# Altium project Receiver - Student Version.PrjPcb
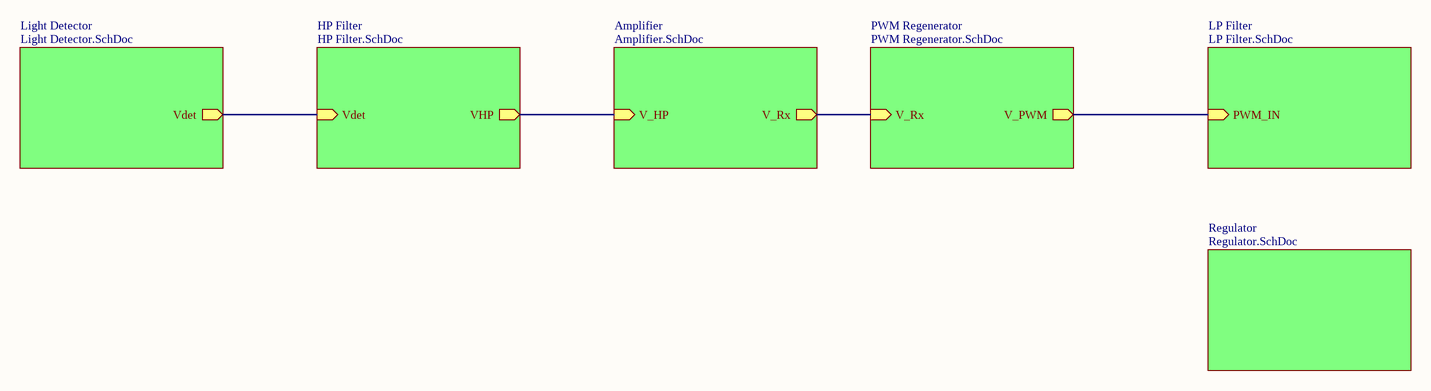
[diagram p0: Receiver.SchDoc]
7 sheets, 36 parts. Net scope: hierarchical (ports join the sheet entries above them; power ports are global).
Board file: Receiver.PcbDoc
Sheets:
  Receiver.SchDoc
    Light Detector = Light Detector.SchDoc
    HP Filter = HP Filter.SchDoc
    Amplifier = Amplifier.SchDoc
    PWM Regenerator = PWM Regenerator.SchDoc
    LP Filter = LP Filter.SchDoc
    Regulator = Regulator.SchDoc

## Sheet Receiver.SchDoc
size A4; SheetNumber: 1; SheetTotal: 6

### Sub-sheets
Amplifier = Amplifier.SchDoc: V_HP (in), V_Rx (out)
HP Filter = HP Filter.SchDoc: VHP (out), Vdet (in)
Light Detector = Light Detector.SchDoc: Vdet (out)
LP Filter = LP Filter.SchDoc: PWM_IN (in)
PWM Regenerator = PWM Regenerator.SchDoc: V_Rx (in), V_PWM (out)
Regulator = Regulator.SchDoc: no entries

### Nets
NetC2_2: sheet Light Detector/Vdet, sheet HP Filter/Vdet
NetC3_2: sheet HP Filter/VHP, sheet Amplifier/V_HP, sheet Amplifier/V_Rx, sheet PWM Regenerator/V_Rx
NetR8_1: sheet PWM Regenerator/V_PWM, sheet LP Filter/PWM_IN

## Sheet Light Detector.SchDoc
size A4; SheetNumber: 2; SheetTotal: 7
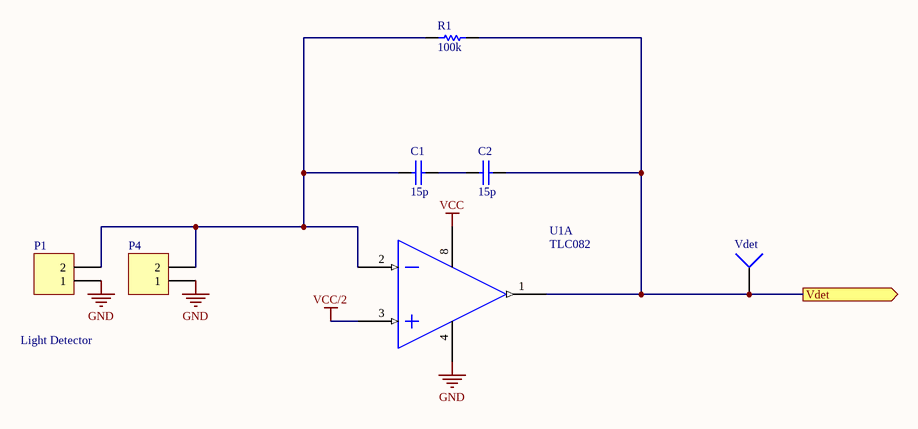
[diagram p1: Light Detector.SchDoc]

### Parts
C1  15p  [ece-RAD0.2]
C2  15p  [ece-RAD0.2]
P1  Header 2  [ece-HDR1X2]  (value not drawn)
P4  Header 2  [ece-HDR1X2]  (value not drawn)
R1  100k  [ece-AXIAL0.4]
U1  TLC082  [ECE-DIP8]  (part A of 2)
VOFF  Vdet  [ece-HDR1]

### Ports
Vdet (out)

### Nets
GND: P1.1 P4.1 U1.4(GND)
VCC: U1.8(V(+))
VCC/2: U1.3(IN1(+))
NetC1_1: C1.1 P1.2 P4.2 R1.1 U1.2(IN1(-))
NetC1_2: C1.2 C2.1
NetC2_2: C2.2 R1.2 U1.1(OUT1) VOFF.1 ; port Vdet

### Notes on the sheet
- Light Detector

### Library data of the parts
C1 C2 = CAP: Capacitor Non Polarised Through Hole; Value: 15p
P1 P4 = Header 2: Header, 2-Pin; LatestRevisionDate: 17-Jul-2002; LatestRevisionNote: Re-released for DXP Platform.; Publisher: Altium Limited
R1 = Res1: Resistor; Published: 8-Jun-2000; LatestRevisionDate: 17-Jul-2002; LatestRevisionNote: Re-released for DXP Platform.; PackageReference: AXIAL-0.3; Publisher: Altium Limited; Value: 100k
VOFF = Test pin: Socket; LatestRevisionDate: 17-Jul-2002; LatestRevisionNote: Re-released for DXP Platform.; Publisher: Altium Limited
U1 = TLC082: Value: TLC082

## Sheet HP Filter.SchDoc
size A4; SheetNumber: 3; SheetTotal: 7
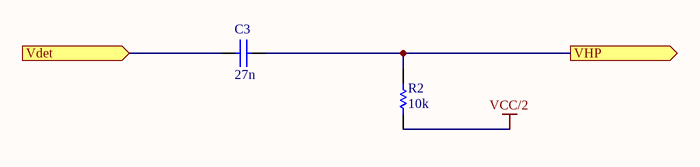
[diagram p2: HP Filter.SchDoc]

### Parts
C3  27n  [ece-RAD0.2]
R2  10k  [ece-AXIAL0.4]

### Ports
Vdet (in), VHP (out)

### Nets
VCC/2: R2.1
NetC2_2: C3.1 ; port Vdet
NetC3_2: C3.2 R2.2 ; port VHP

### Library data of the parts
C3 = CAP: Capacitor Non Polarised Through Hole; Value: 27n
R2 = Res1: Resistor; Published: 8-Jun-2000; LatestRevisionDate: 17-Jul-2002; LatestRevisionNote: Re-released for DXP Platform.; PackageReference: AXIAL-0.3; Publisher: Altium Limited; Value: 10k

## Sheet Amplifier.SchDoc
size A4; SheetNumber: 4; SheetTotal: 7
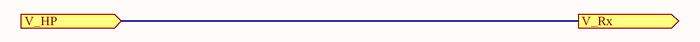
[diagram p3: Amplifier.SchDoc]

### Ports
V_HP (in), V_Rx (out)

### Nets
NetC3_2: port V_HP, port V_Rx

## Sheet PWM Regenerator.SchDoc
size A4; SheetNumber: 5; SheetTotal: 7
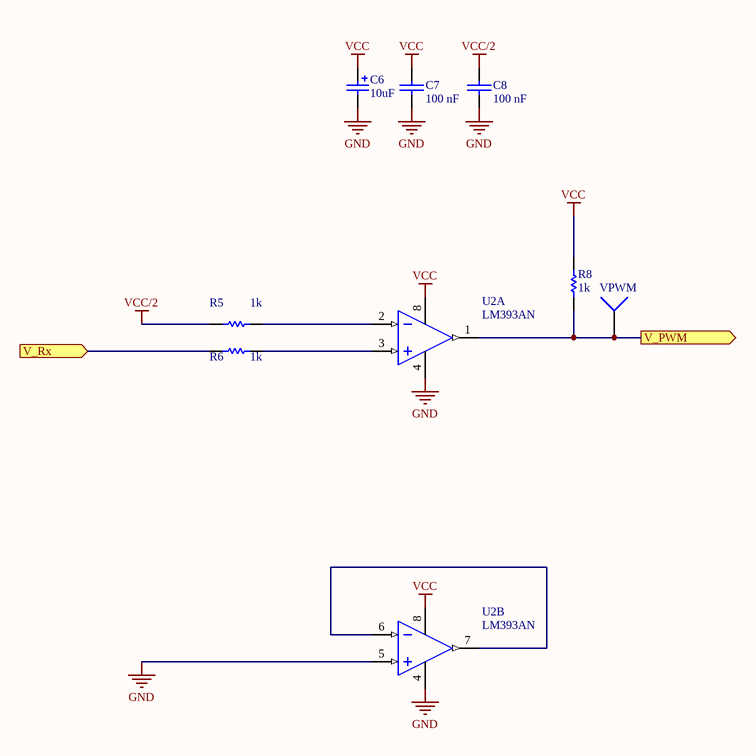
[diagram p4: PWM Regenerator.SchDoc]

### Parts
C6  10uF  [ece-CAPAD2TH0.3]
C7  100 nF  [ece-RAD0.2]
C8  100 nF  [ece-RAD0.2]
R5  1k  [ece-AXIAL0.4]
R6  1k  [ece-AXIAL0.4]
R8  1k  [ece-AXIAL0.4]
U2  LM393AN  [ECE-DIP8]  (parts A,B of 2)
VPWM  VPWM  [ece-HDR1]

### Ports
V_PWM (out), V_Rx (in)

### Nets
GND: C6.2 C7.2 C8.2 U2.4(GND) U2.5(IN+)
VCC: C6.1 C7.1 R8.2 U2.8(V+)
VCC/2: C8.1 R5.1
NetC3_2: R6.1 ; port V_Rx
NetR5_2: R5.2 U2.2(IN-)
NetR6_2: R6.2 U2.3(IN+)
NetR8_1: R8.1 U2.1(OUT) VPWM.1 ; port V_PWM
NetU2_6: U2.6(IN-) U2.7(OUT)

### Library data of the parts
C6 = CAP 22uF TH: Polarized Capacitor (Radial); Manufacturer: Generic Components; Class I: Passive; Published: 8-Jun-2000; Revision: July-2002: Re-released for DXP Platform.; Publisher: Altium Limited; Class II: Capacitor; Value: 10uF
C7 C8 = CAP: Capacitor Non Polarised Through Hole; Value: 100 nF
R5 R6 R8 = Res1: Resistor; Published: 8-Jun-2000; LatestRevisionDate: 17-Jul-2002; LatestRevisionNote: Re-released for DXP Platform.; PackageReference: AXIAL-0.3; Publisher: Altium Limited; Value: 1k
U2 = LM393AN: Dual Comparator; Published: 17-Jul-2002; LatestRevisionDate: 06-Jun-2005; LatestRevisionNote: Stylized 3D Model Added.; DatasheetVersion: 1988; PackageReference: 626-05; Publisher: Altium Limited; PackageDescription: DIP; 8 Leads; Row Spacing 7.62 mm; Pitch 2.54 mm; ComponentLink1Description: Manufacturer Link; ComponentLink1URL: http://www.onsemi.com/site/products/taxonomy/0,4438,133,00.html
VPWM = Test pin: Socket; LatestRevisionDate: 17-Jul-2002; LatestRevisionNote: Re-released for DXP Platform.; Publisher: Altium Limited

## Sheet LP Filter.SchDoc
size A4; SheetNumber: 6; SheetTotal: 7
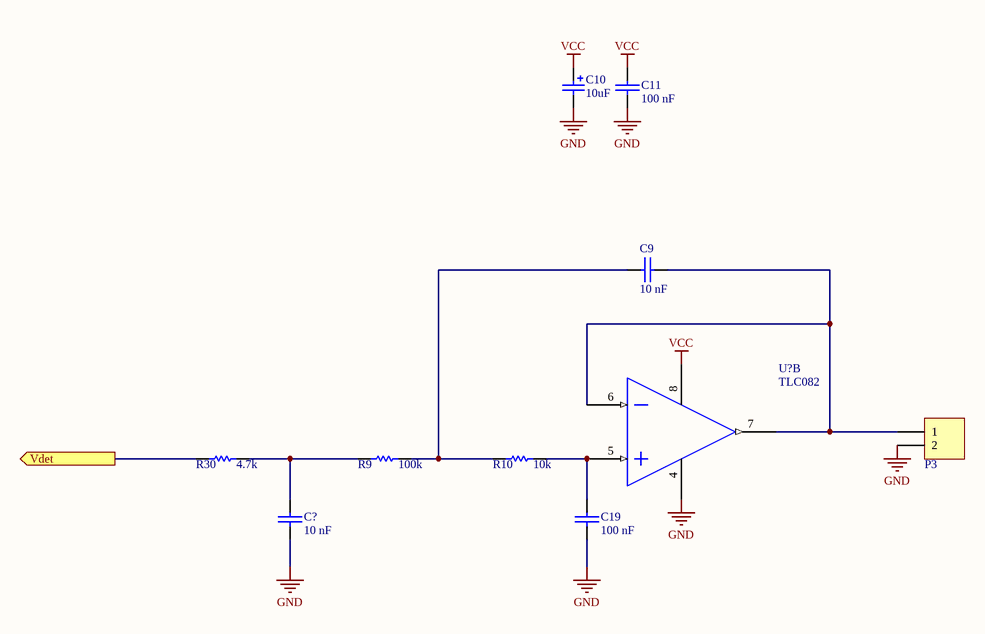
[diagram p5: LP Filter.SchDoc]

### Parts
C9  10 nF  [ece-RAD0.2]
C10  10uF  [ece-CAPAD2TH0.3]
C11  100 nF  [ece-RAD0.2]
C19  100 nF  [ece-RAD0.2]
C?  10 nF  [ece-RAD0.2]
P3  Connector2way  [ece-TER-2.02]  (value not drawn)
R9  100k  [ece-AXIAL0.4]
R10  10k  [ece-AXIAL0.4]
R30  4.7k  [ece-AXIAL0.4]
U?  TLC082  [ECE-DIP8]  (part B of 2)

### Ports
Vdet (out)

### Nets
GND: C10.2 C11.2 C19.2 C?.2 P3.2 U?.4(GND)
VCC: C10.1 C11.1 U?.8(V(+))
NetC9_1: C9.1 R9.2 R10.1
NetC9_2: C9.2 P3.1 U?.6(IN2(-)) U?.7(OUT2)
NetC19_1: C19.1 R10.2 U?.5(IN2(+))
NetC?_1: C?.1 R9.1 R30.2
NetR30_1: R30.1 ; port Vdet

### Library data of the parts
C9 C11 C19 C? = CAP: Capacitor Non Polarised Through Hole
  C9 C?: Value: 10 nF
  C11 C19: Value: 100 nF
C10 = CAP 22uF TH: as C6 on sheet PWM Regenerator; Published: 8-Jun-2000; Revision: July-2002: Re-released for DXP Platform.; Publisher: Altium Limited; Class II: Capacitor; Value: 10uF
P3 = Connector2way: 2 way screw connector
R9 R10 R30 = Res1: Resistor; Published: 8-Jun-2000; LatestRevisionDate: 17-Jul-2002; LatestRevisionNote: Re-released for DXP Platform.; PackageReference: AXIAL-0.3; Publisher: Altium Limited
  R9: Value: 100k
  R10: Value: 10k
  R30: Value: 4.7k
U? = TLC082: Value: TLC082

## Sheet Regulator.SchDoc
size A4; SheetNumber: 7; SheetTotal: 7
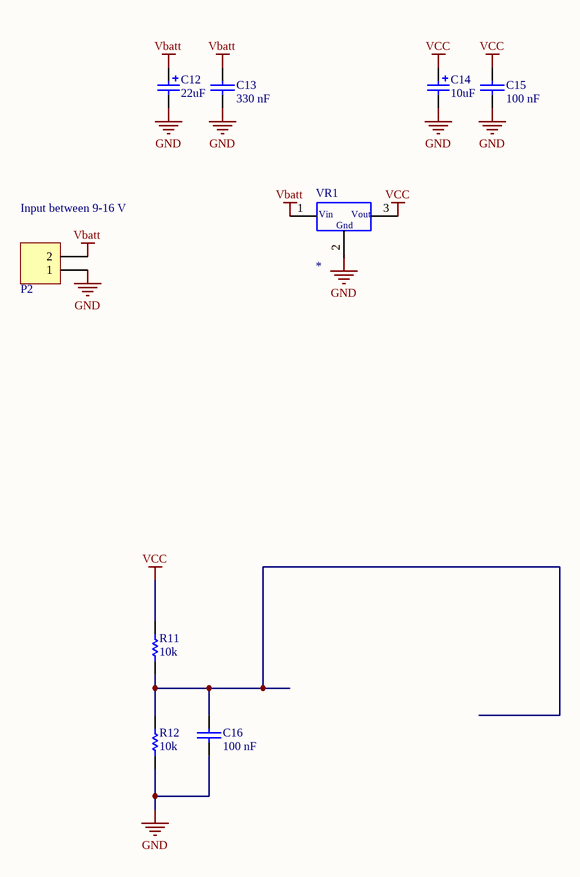
[diagram p6: Regulator.SchDoc]

### Parts
C12  22uF  [ece-CAPAD2TH0.3]
C13  330 nF  [ece-RAD0.2]
C14  10uF  [ece-CAPAD2TH0.3]
C15  100 nF  [ece-RAD0.2]
C16  100 nF  [ece-RAD0.2]
P2  Connector2way  [ece-TER-2.02]  (value not drawn)
R11  10k  [ece-AXIAL0.4]
R12  10k  [ece-AXIAL0.4]
VR1  *  [ece-TO220]

### Nets
GND: C12.2 C13.2 C14.2 C15.2 C16.2 P2.1 R12.1 VR1.2(Gnd)
Vbatt: C12.1 C13.1 P2.2 VR1.1(Vin)
VCC: C14.1 C15.1 R11.2 VR1.3(Vout)
NetC16_1: C16.1 R11.1 R12.2

### Notes on the sheet
- (near P2) Input between 9-16 V

### Library data of the parts
C12 C14 = CAP 22uF TH: as C6 on sheet PWM Regenerator; Published: 8-Jun-2000; Revision: July-2002: Re-released for DXP Platform.; Publisher: Altium Limited; Class II: Capacitor
  C12: Value: 22uF
  C14: Value: 10uF
C13 C15 C16 = CAP: Capacitor Non Polarised Through Hole
  C13: Value: 330 nF
  C15 C16: Value: 100 nF
P2 = Connector2way: 2 way screw connector
R11 R12 = Res1: Resistor; Published: 8-Jun-2000; LatestRevisionDate: 17-Jul-2002; LatestRevisionNote: Re-released for DXP Platform.; PackageReference: AXIAL-0.3; Publisher: Altium Limited; Value: 10k
VR1 = VoltRegBig: Voltage Regulator; Value: *

## Nets that join several sheets
GND: Light Detector (P1.1 P4.1 U1.4), PWM Regenerator (5 pins), LP Filter (6 pins), Regulator (8 pins)
VCC: Light Detector (U1.8), PWM Regenerator (C6.1 C7.1 R8.2 U2.8), LP Filter (C10.1 C11.1 U?.8), Regulator (C14.1 C15.1 R11.2 VR1.3)
VCC/2: Light Detector (U1.3), HP Filter (R2.1), PWM Regenerator (C8.1 R5.1)
NetC2_2: Light Detector (C2.2 R1.2 U1.1 VOFF.1), HP Filter (C3.1)
NetC3_2: HP Filter (C3.2 R2.2), PWM Regenerator (R6.1)